# EAGLE design board (EAGLE 6.3)
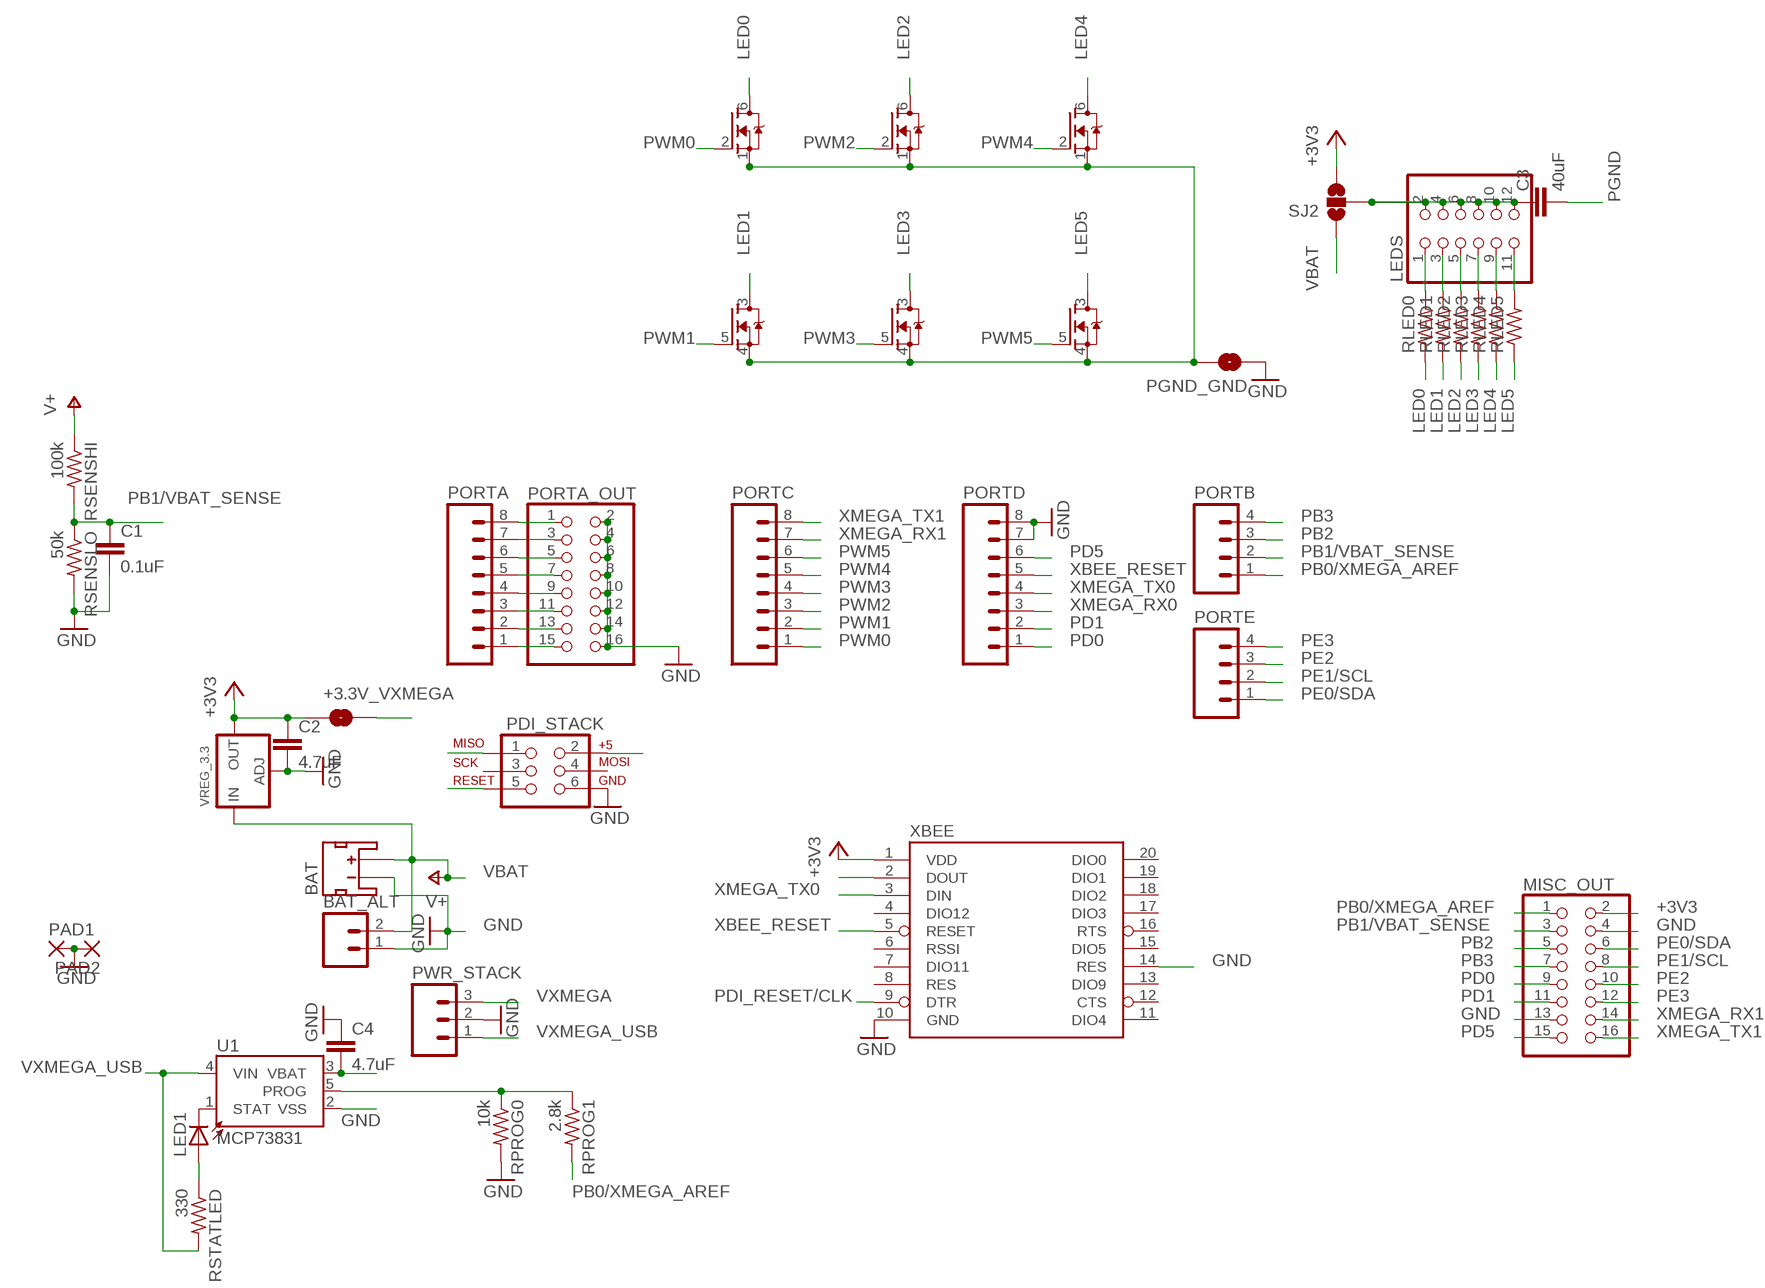
[diagram p0: schematic, sheet 1]

## Parts
+3.3V_VXMEGA  SOLDERJUMPERTRACE  [SJ_2S-TRACE]
BAT  JST_2MM_MALE  [JST-2-SMD]
BAT_ALT  M02PTH  [1X02]
C1  0.1uF  C-EUC0603K  [C0603K]
C2  4.7uF  C-EUC0805K  [C0805K]
C3  40uF  C-EUC1210  [C1210]
C4  4.7uF  C-EUC0805  [C0805]
DRV0  MOSFET-N_DUAL  [SOT363]
DRV1  MOSFET-N_DUAL  [SOT363]
DRV2  MOSFET-N_DUAL  [SOT363]
LED1  LEDCHIP-LED0603  [CHIP-LED0603]
LEDS  PINHD-2X6/90  [2X06/90]
MISC_OUT  PINHD-2X8/90  [2X08/90]
PAD1  3,81/1,4  [3,81/1,4]
PAD2  3,81/1,4  [3,81/1,4]
PDI_STACK  AVR_SPI_PRG_6NS  [2X3-NS]
PGND_GND  SOLDERJUMPERTRACE  [SJ_2S-TRACE]
PORTA  M081X08  [1X08]
PORTA_OUT  PINHD-2X8  [2X08]
PORTB  M04PTH  [1X04]
PORTC  M081X08  [1X08]
PORTD  M081X08  [1X08]
PORTE  M04PTH  [1X04]
PWR_STACK  M03PTH  [1X03]
RLED0  R-US_R0805  [R0805]
RLED1  R-US_R0805  [R0805]
RLED2  R-US_R0805  [R0805]
RLED3  R-US_R0805  [R0805]
RLED4  R-US_R0805  [R0805]
RLED5  R-US_R0805  [R0805]
RPROG0  10k  R-US_R0603  [R0603]
RPROG1  2.8k  R-US_R0603  [R0603]
RSENSHI  100k  R-US_R0603  [R0603]
RSENSLO  50k  R-US_R0603  [R0603]
RSTATLED  330  R-US_R0603  [R0603]
SJ2  SOLDERJUMPER_2WAY-OLDT  [SJ_2]
U1  MCP73831  [SOT23-5]
VREG_3.3  LM1117SOT223-WAVE  [SOT223-W]
XBEE  XBEE-1B2  [XBEE-SILK]

## Nets
+3V3 [PWR]: +3.3V_VXMEGA.1 C2.1 MISC_OUT.2 SJ2.3 VREG_3.3.2(OUT) XBEE.1(VDD)
GND [PWR]: BAT.1(-) BAT_ALT.1 C1.2 C2.2 C4.1 MISC_OUT.4 MISC_OUT.13 PAD1.1(P) PAD2.1(P) PDI_STACK.6 PGND_GND.1 PORTA_OUT.2 PORTA_OUT.4 PORTA_OUT.6 PORTA_OUT.8 PORTA_OUT.10 PORTA_OUT.12 PORTA_OUT.14 PORTA_OUT.16 PORTD.7 PORTD.8 PWR_STACK.2 RPROG0.2 RSENSLO.2 U1.2(VSS) VREG_3.3.1(ADJ) XBEE.10(GND) XBEE.14(RES)
LED0 [PWR]: DRV0.6(D) RLED0.1
LED0R [PWR]: LEDS.1 RLED0.2
LED1 [PWR]: DRV0.3(D) RLED1.1
LED1R [PWR]: LEDS.3 RLED1.2
LED2 [PWR]: DRV1.6(D) RLED2.1
LED2R [PWR]: LEDS.5 RLED2.2
LED3 [PWR]: DRV1.3(D) RLED3.1
LED3R [PWR]: LEDS.7 RLED3.2
LED4 [PWR]: DRV2.6(D) RLED4.1
LED4R [PWR]: LEDS.9 RLED4.2
LED5 [PWR]: DRV2.3(D) RLED5.1
LED5R [PWR]: LEDS.11 RLED5.2
N$2: LED1.C U1.1(STAT)
N$3: LED1.A RSTATLED.1
PA0: PORTA.1 PORTA_OUT.15
PA1: PORTA.2 PORTA_OUT.13
PA2: PORTA.3 PORTA_OUT.11
PA3: PORTA.4 PORTA_OUT.9
PA4: PORTA.5 PORTA_OUT.7
PA5: PORTA.6 PORTA_OUT.5
PA6: PORTA.7 PORTA_OUT.3
PA7: PORTA.8 PORTA_OUT.1
PB0/XMEGA_AREF: MISC_OUT.1 PORTB.1 RPROG1.2
PB1/VBAT_SENSE: C1.1 MISC_OUT.3 PORTB.2 RSENSHI.2 RSENSLO.1
PB2: MISC_OUT.5 PORTB.3
PB3: MISC_OUT.7 PORTB.4
PD0: MISC_OUT.9 PORTD.1
PD1: MISC_OUT.11 PORTD.2
PD5: MISC_OUT.15 PORTD.6
PDI_DATA: PDI_STACK.1
PDI_RESET/CLK: PDI_STACK.5 XBEE.9(DTR)
PE0/SDA: MISC_OUT.6 PORTE.1
PE1/SCL: MISC_OUT.8 PORTE.2
PE2: MISC_OUT.10 PORTE.3
PE3: MISC_OUT.12 PORTE.4
PGND [PWR]: C3.2 DRV0.1(S) DRV0.4(S) DRV1.1(S) DRV1.4(S) DRV2.1(S) DRV2.4(S) PGND_GND.2
PWM0: DRV0.2(G) PORTC.1
PWM1: DRV0.5(G) PORTC.2
PWM2: DRV1.2(G) PORTC.3
PWM3: DRV1.5(G) PORTC.4
PWM4: DRV2.2(G) PORTC.5
PWM5: DRV2.5(G) PORTC.6
RPROG: RPROG0.1 RPROG1.1 U1.5(PROG)
VBAT [PWR]: BAT.2(+) BAT_ALT.2 C4.2 RSENSHI.1 SJ2.1 U1.3(VBAT) VREG_3.3.3(IN) ; supply symbol labelled V+
VLED [PWR]: C3.1 LEDS.2 LEDS.4 LEDS.6 LEDS.8 LEDS.10 LEDS.12 SJ2.2
VXMEGA: +3.3V_VXMEGA.2 PDI_STACK.2 PWR_STACK.3
VXMEGA_USB [PWR]: PWR_STACK.1 RSTATLED.2 U1.4(VIN)
XBEE_RESET: PORTD.5 XBEE.5(RESET)
XMEGA_RX0: PORTD.3 XBEE.2(DOUT)
XMEGA_RX1: MISC_OUT.14 PORTC.7
XMEGA_TX0: PORTD.4 XBEE.3(DIN)
XMEGA_TX1: MISC_OUT.16 PORTC.8
Unconnected: BAT.NC1(PAD1) BAT.NC2(PAD2) PDI_STACK.3 PDI_STACK.4 XBEE.4(DIO12) XBEE.6(RSSI) XBEE.7(DIO11) XBEE.8(RES) XBEE.11(DIO4) XBEE.12(CTS) XBEE.13(DIO9) XBEE.15(DIO5) XBEE.16(RTS) XBEE.17(DIO3) XBEE.18(DIO2) XBEE.19(DIO1) XBEE.20(DIO0)

## Library data of the parts
+3.3V_VXMEGA PGND_GND = SparkFun-Passives:SOLDERJUMPER: Solder Jumper Standard SMD solder jumper. Used to automate production. Two varients : Normally Open and Normally Closed are the same, but have different paste layers. NC will have a large amount of paste and should jumper during reflow.
BAT = SparkFun-Connectors:JST_2MM_MALE: Mates to single-cell LiPo batteries. CONN-08352; PROD_ID: CONN-08352
BAT_ALT = SparkFun-Connectors:M02: Header 2 Standard 2-pin 0.1" header. Use with straight break away headers (SKU : PRT-00116), right angle break away headers (PRT-00553), swiss pins (PRT-00743), machine pins (PRT-00117), and female headers (PRT-00115). Molex polarized connector foot print use with SKU : PRT-08233 with associated crimp pins and housings.
C1-C4 = rcl:C-EU: CAPACITOR, European symbol
DRV0 DRV1 DRV2 = microbuilder:MOSFET-N_DUAL: Dual N-Channel MOSFET SOT363 (2.0x1.25mm) 2N7002PS - 60V, 320mA [Digikey: 568-5984-1-ND]
LED1 = led:LED: LED OSRAM: - CHIPLED LG R971, LG N971, LY N971, LG Q971, LY Q971, LO R971, LY R971 LH N974, LH R974 LS Q976, LO Q976, LY Q976 LO Q996 - Hyper CHIPLED LW Q18S LB Q993, LB Q99A, LB R99A - SideLED LS A670, LO A670, LY A670, LG A670, LP A670 LB A673, LV A673, LT A673, LW A673 LH A674 LY A675 LS A676, LA A676, LO A676, LY A676, LW A676 LS A679, LY A679, LG A679 - Hyper Micro SIDELED® LS Y876, LA Y876, LO Y876, LY Y876 LT Y87S - SmartLED LW L88C, LW L88S LB L89C, LB L89S, LG L890 LS L89K, LO L89K, LY L89K LS L896, LA L896, LO L896, LY L896 - TOPLED LS T670, LO T670, LY T670, LG T670, LP T670 LSG T670, LSP T670, LSY T670, LOP T670, LYG T670 LG T671, LOG T671, LSG T671 LB T673, LV T673, LT T673, LW T673 LH T674 LS T676, LA T676, LO T676, LY T676, LB T676, LH T676, LSB T676, LW T676 LB T67C, LV T67C, LT T67C, LS T67K, LO T67K, LY T67K, LW E67C LS E67B, LA E67B, LO E67B, LY E67B, LB E67C, LV E67C, LT E67C LW T67C LS T679, LY T679, LG T679 LS T770, LO T770, LY T770, LG T770, LP T770 LB T773, LV T773, LT T773, LW T773 LH T774 LS E675, LA E675, LY E675, LS T675 LS T776, LA T776, LO T776, LY T776, LB T776 LHGB T686 LT T68C, LB T68C - Hyper Mini TOPLED® LB M676 - Mini TOPLED Santana® LG M470 LS M47K, LO M47K, LY M47K Source: http://www.osram.convergy.de LUXEON: - LUMILED® LXK2-PW12-R00, LXK2-PW12-S00, LXK2-PW14-U00, LXK2-PW14-V00 LXK2-PM12-R00, LXK2-PM12-S00, LXK2-PM14-U00 LXK2-PE12-Q00, LXK2-PE12-R00, LXK2-PE12-S00, LXK2-PE14-T00, LXK2-PE14-U00 LXK2-PB12-K00, LXK2-PB12-L00, LXK2-PB12-M00, LXK2-PB14-N00, LXK2-PB14-P00, LXK2-PB14-Q00 LXK2-PR12-L00, LXK2-PR12-M00, LXK2-PR14-Q00, LXK2-PR14-R00 LXK2-PD12-Q00, LXK2-PD12-R00, LXK2-PD12-S00 LXK2-PH12-R00, LXK2-PH12-S00 LXK2-PL12-P00, LXK2-PL12-Q00, LXK2-PL12-R00 Source: www.luxeon.com KINGBRIGHT: KA-3528ASYC Source: www.kingbright.com
LEDS = pinhead:PINHD-2X6: PIN HEADER
MISC_OUT PORTA_OUT = pinhead:PINHD-2X8: PIN HEADER
PAD1 PAD2 = wirepad:3,81/1,4: THROUGH-HOLE PAD
PDI_STACK = SparkFun-Connectors:AVR_SPI_PRG_6: AVR ISP 6 Pin This is the reduced ISP connector for AVR programming. Common on Arduino. This footprint will take up less PCB space and can be used with a 10-pin to 6-pin adapter such as SKU: BOB-08508
PORTA PORTC PORTD = SparkFun-Connectors:M08: Header 8 Standard 8-pin 0.1" header. Use with straight break away headers (SKU : PRT-00116), right angle break away headers (PRT-00553), swiss pins (PRT-00743), machine pins (PRT-00117), and female headers (PRT-00115).
PORTB PORTE = SparkFun-Connectors:M04: Header 4 Standard 4-pin 0.1" header. Use with straight break away headers (SKU : PRT-00116), right angle break away headers (PRT-00553), swiss pins (PRT-00743), machine pins (PRT-00117), and female headers (PRT-00115). Molex polarized connector foot print use with SKU : PRT-08231 with associated crimp pins and housings. 1MM SMD Version SKU: PRT-10208
PWR_STACK = SparkFun-Connectors:M03: Header 3 Standard 3-pin 0.1" header. Use with straight break away headers (SKU : PRT-00116), right angle break away headers (PRT-00553), swiss pins (PRT-00743), machine pins (PRT-00117), and female headers (PRT-00115). Molex polarized connector foot print use with SKU : PRT-08232 with associated crimp pins and housings.
RLED0 RLED1-RLED5 = resistor:R-US_: RESISTOR, American symbol
RPROG0 RPROG1 RSENSHI RSENSLO RSTATLED = rcl:R-US_: RESISTOR, American symbol
SJ2 = SparkFun-Passives:SOLDERJUMPER_2WAY-OLD: Solder Jumper 2 way solder jumper
U1 = SparkFun-PowerIC:MCP73831: Miniature single cell, fully integrated Li-Ion, Li-polymer charge management controller http://ww1.microchip.com/downloads/en/DeviceDoc/21984a.pdf
VREG_3.3 = microbuilder:LM1117: LM1117 Voltage Regulator LM1117 Adjustable Voltage regulator [Digikey: LM1117IMP-ADJDKR-ND] LM1117 3.3V Voltage regulator [AP1117E33GDIDKR-ND] LM1117 5.0V Voltage regulator [AP1117E50GDIDKR-ND] SOT223-REFLOW - SOT223 package for solder paste/reflow ovens SOT223-WAVE - SOT223 package for hand-soldering (larger pads) Note: For the fixed-voltage regulators, simply set the ADJ pin to GND.
XBEE = SparkFun-RF:XBEE-1: Xbee module footprints SMT header is CONN-09042.

## Net classes
1 PWR: width 0.305 mm

## Board
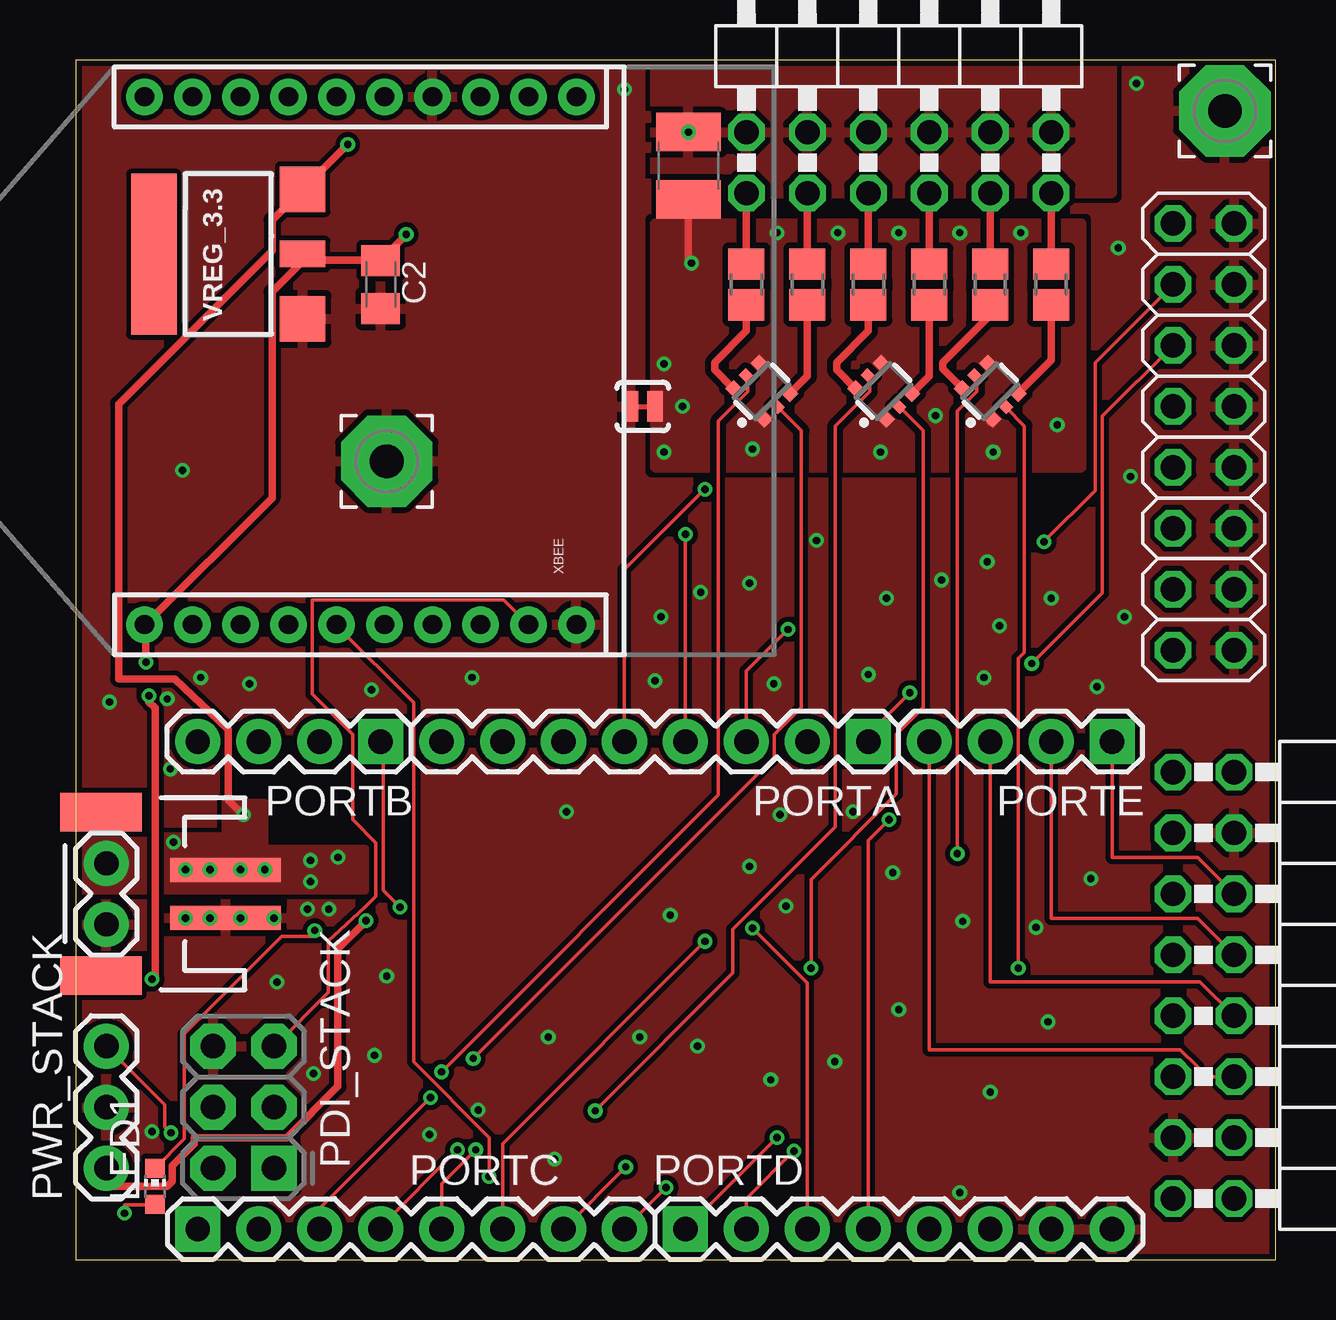
[diagram p1: board, top side]
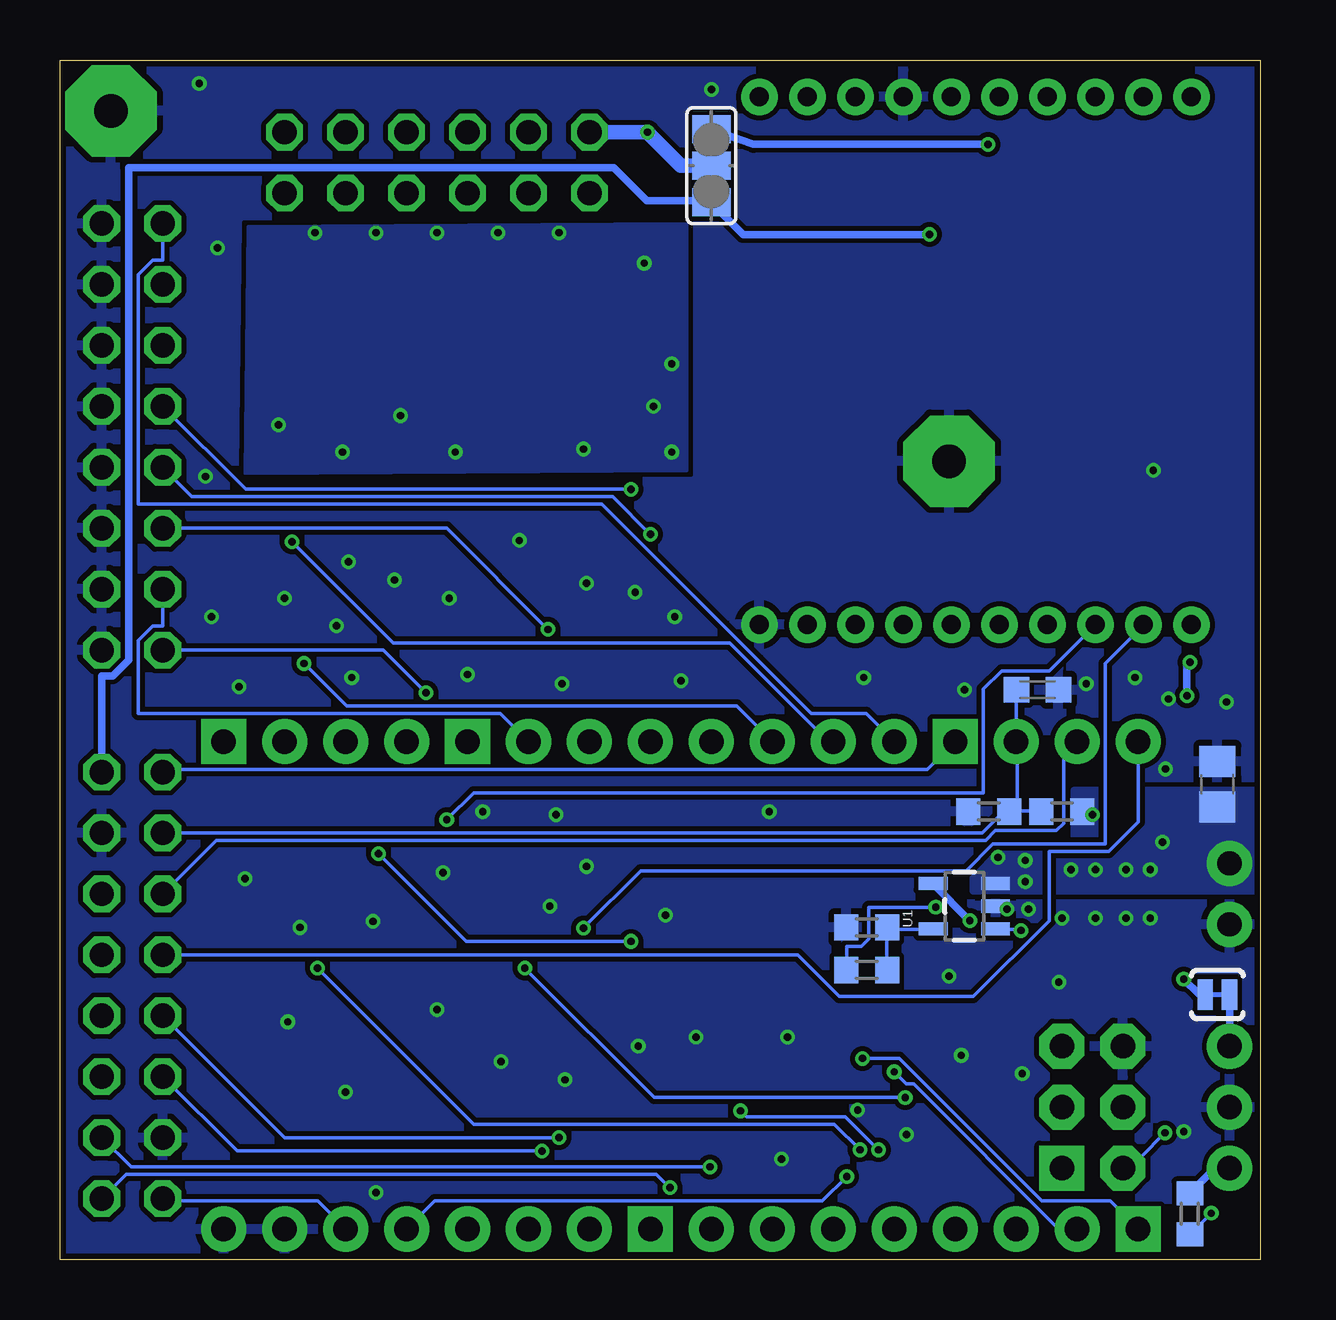
[diagram p2: board, bottom side, seen from below]

Size 50 x 50 mm. Coordinates in mm from the lower left corner, seen from the top.
Outline: 0,0 50,0 50,50 0,50 0,0
Copper layers (1*16): Top 0.035mm / dielectric 1.5mm / Bottom 0.035mm
Design rules "Fusion_eagle_rule_v1.1": minimum track width 6mil, minimum drill 12mil, track to track 6mil, track to pad 6mil, pad to pad 6mil, via to via 6mil, smd to smd 0mil, copper to edge 10mil, drill to drill 10mil, minimum pad ring 10mil, minimum via ring 6mil, stop-mask expansion 2mil, vias tented up to drill 100mil, thermal gap 10mil

### Footprints (pad centres in the part's own frame; a part is rotated, then mirrored left to right if it is on the bottom)
SJ_2S-TRACE = smd 0.635 x 1.27: 1 -0.508,0; 2 0.508,0
JST-2-SMD = smd 1 x 4.6: 1 -1,-3.7; 2 1,-3.7 | smd 1.6 x 3.4: NC1 -3.4,1.5; NC2 3.4,1.5
1X02 = drill 1.016 pad 1.88: 1 0,0; 2 2.54,0
C0603K = smd 1.05 x 1.08: 1 -0.875,0; 2 0.875,0
C0805K = smd 1.3 x 1.6: 1 -1,0; 2 1,0
C1210 = smd 1.6 x 2.7: 1 -1.4,0; 2 1.4,0
C0805 = smd 1.3 x 1.5: 1 -0.95,0; 2 0.95,0
SOT363 = smd 0.5 x 0.5: 1 -0.75,-0.9; 3 0.75,-0.9; 4 0.75,0.9; 6 -0.75,0.9 | smd 0.4 x 0.5: 2 0,-0.9; 5 0,0.9
CHIP-LED0603 = smd 0.8 x 0.8: A 0,-0.75; C 0,0.75
2X06/90 = drill 1.016 octagon: 1 -6.35,-6.35; 2 -6.35,-3.81; 3 -3.81,-6.35; 4 -3.81,-3.81; 5 -1.27,-6.35; 6 -1.27,-3.81; 7 1.27,-6.35; 8 1.27,-3.81; 9 3.81,-6.35; 10 3.81,-3.81; 11 6.35,-6.35; 12 6.35,-3.81
2X08/90 = drill 1.016 octagon: 1 -8.89,-6.35; 2 -8.89,-3.81; 3 -6.35,-6.35; 4 -6.35,-3.81; 5 -3.81,-6.35; 6 -3.81,-3.81; 7 -1.27,-6.35; 8 -1.27,-3.81; 9 1.27,-6.35; 10 1.27,-3.81; 11 3.81,-6.35; 12 3.81,-3.81; 13 6.35,-6.35; 14 6.35,-3.81; 15 8.89,-6.35; 16 8.89,-3.81
3,81/1,4 = drill 1.397 pad 3.81 octagon: 1 0,0
2X3-NS = drill 1.016 pad 1.88 square: 1 -2.54,-1.27 | drill 1.016 pad 1.88 octagon: 2 -2.54,1.27; 3 0,-1.27; 4 0,1.27; 5 2.54,-1.27; 6 2.54,1.27
1X08 = drill 1.016 pad 1.88 square: 1 0,0 | drill 1.016 pad 1.88: 2 2.54,0; 3 5.08,0; 4 7.62,0; 5 10.16,0; 6 12.7,0; 7 15.24,0; 8 17.78,0
2X08 = drill 1.016 octagon: 1 -8.89,-1.27; 2 -8.89,1.27; 3 -6.35,-1.27; 4 -6.35,1.27; 5 -3.81,-1.27; 6 -3.81,1.27; 7 -1.27,-1.27; 8 -1.27,1.27; 9 1.27,-1.27; 10 1.27,1.27; 11 3.81,-1.27; 12 3.81,1.27; 13 6.35,-1.27; 14 6.35,1.27; 15 8.89,-1.27; 16 8.89,1.27
1X04 = drill 1.016 pad 1.88 square: 1 0,0 | drill 1.016 pad 1.88: 2 2.54,0; 3 5.08,0; 4 7.62,0
1X03 = drill 1.016 pad 1.88: 1 0,0; 2 2.54,0; 3 5.08,0
R0805 = smd 1.3 x 1.5: 1 -0.85,0; 2 0.85,0
R0603 = smd 1 x 1.1: 1 -0.85,0; 2 0.85,0
SJ_2 = smd 1.168 x 1.6: 1 -1.524,0; 2 0,0; 3 1.524,0
SOT23-5 = smd 0.55 x 1.2: 1 -0.95,-1.3; 2 0,-1.3; 3 0.95,-1.3; 4 0.95,1.3; 5 -0.95,1.3
SOT223-W = smd 1.9 x 1.9: 1 -2.7,-3.1; 3 2.7,-3.1 | smd 1.1 x 1.9: 2 0,-3.1 | smd 6.7 x 1.9: 4 0,3.1
XBEE-SILK = drill 0.8 pad 1.524: 1 -11,20; 2 -11,18; 3 -11,16; 4 -11,14; 5 -11,12; 6 -11,10; 7 -11,8; 8 -11,6; 9 -11,4; 10 -11,2; 11 11,2; 12 11,4; 13 11,6; 14 11,8; 15 11,10; 16 11,12; 17 11,14; 18 11,16; 19 11,18; 20 11,20

### Placement (x,y rotation side)
+3.3V_VXMEGA  1.78,11.05 0 bottom
BAT  2.54,15.24 90 top
BAT_ALT  1.27,13.97 90 top
C1  9.27,23.75 0 bottom
C2  12.7,40.64 270 top
C3  25.53,45.59 270 top
C4  1.78,19.81 270 bottom
DRV0  28.57,36.2 45 top
DRV1  33.66,36.2 45 top
DRV2  38.1,36.2 45 top
LED1  3.3,3.05 0 top
LEDS  34.29,50.8 0 top
MISC_OUT  52.07,11.43 270 top
PAD1  47.88,47.88 0 top
PAD2  12.95,33.27 0 top
PDI_STACK  6.99,6.35 90 top
PGND_GND  23.62,35.56 0 top
PORTA  33.02,21.59 180 top
PORTA_OUT  46.99,34.29 270 top
PORTB  12.7,21.59 180 top
PORTC  5.08,1.27 0 top
PORTD  25.4,1.27 0 top
PORTE  43.18,21.59 180 top
PWR_STACK  1.27,3.81 90 top
RLED0  27.94,40.64 90 top
RLED1  30.48,40.64 90 top
RLED2  33.02,40.64 90 top
RLED3  35.56,40.64 90 top
RLED4  38.1,40.64 90 top
RLED5  40.64,40.64 90 top
RPROG0  16.38,13.84 180 bottom
RPROG1  16.38,12.06 180 bottom
RSENSHI  8.26,18.67 180 bottom
RSENSLO  11.3,18.67 180 bottom
RSTATLED  2.92,1.91 90 bottom
SJ2  22.86,45.59 270 bottom
U1  12.32,14.73 90 bottom
VREG_3.3  6.35,41.91 90 top
XBEE  22.86,37.47 90 top

### Tracks (layer width: path | path; a pad name or v marks a point on that pad's centre or on a via)
+3V3  (via drill 0.3)
  Top 0.305: v13.77,42.72 12.8,41.76 C2.1 12.7,41.66 9.5,41.66 9.5,41.91 VREG_3.3.2 9.4,41.55 8.18,40.34 8.18,31.75 2.9,26.47 XBEE.1 2.92,26.42 v2.92,24.89 | v3.17,11.68 3.3,11.81 3.3,22.99 3.05,23.24 v3.05,23.5
  Bottom 0.305: v13.77,42.72 21.54,42.72 22.86,44.04 SJ2.3 22.96,44.15 25.55,44.15 26.92,45.52 47.14,45.52 47.14,24.99 47.8,24.33 48.26,24.33 MISC_OUT.2 | v3.05,23.5 3.05,24.89 v2.92,24.89 | +3.3V_VXMEGA.1 2.54,11.05 v3.17,11.68
GND  (via drill 0.3, 0.3 pad 0.61)
  other vias: 22.86,48.77 44.2,49.02 43.43,42.16 9.65,14.61 8.26,14.22 6.86,14.22 5.59,14.22 4.45,32.89 16.51,24.26 34.04,16.13 34.29,10.41 38.1,6.99 40.51,9.91 42.29,15.88 40.01,13.84 36.96,14.1 31.62,8.26 28.96,7.49 25.91,8.89 23.5,9.27 19.68,9.27 24.77,14.35 28.07,16.38 20.45,18.67 12.45,8.51 12.95,11.81 5.21,24.26 7.24,24 3.81,23.37 12.32,23.75 8.38,11.56 9.91,7.75 16.76,6.22 14.73,5.21 3.17,5.33 42.55,23.88 43.69,26.8 40.64,27.56 37.97,29.08 33.78,27.56 33.02,24.38 28.07,28.19 36.07,28.32 38.48,26.42 37.85,24.26 29.08,24 24.13,24.13 24.38,26.8 26.04,27.81 30.86,29.97 43.94,32.64 29.34,18.54 32.38,18.67 29.59,14.73 10.54,14.61 1.4,23.24 3.94,20.45 4.57,14.22 36.83,2.79 19.94,4.19
  pour Top (isolate 0.203, rank 6): -1.27,50.8 -1.27,-1.27 50.8,-1.27 50.8,50.8
  pour Bottom (isolate 0.203, rank 6): -2.54,52.07 -2.54,-2.54 53.34,-2.54 53.34,52.07
LED0
  Top 0.305: DRV0.6 27.38,36.32 26.62,37.08 26.62,37.39 27.94,38.71 27.94,39.78 RLED0.1
LED0R
  Top 0.305: RLED0.2 LEDS.1
LED1
  Top 0.305: DRV0.3 29.77,36.12 30.48,36.83 30.48,39.78 RLED1.1
LED1R
  Top 0.305: RLED1.2 LEDS.3
LED2
  Top 0.305: DRV1.6 32.46,36.32 31.7,37.08 31.7,37.39 33.02,38.71 33.02,39.78 RLED2.1
LED2R
  Top 0.305: RLED2.2 LEDS.5
LED3
  Top 0.305: DRV1.3 34.85,36.12 35.56,36.83 35.56,39.78 RLED3.1
LED3R
  Top 0.305: RLED3.2 LEDS.7
LED4
  Top 0.305: DRV2.6 36.93,36.32 36.12,37.13 36.12,37.39 38.1,39.37 38.1,39.78 RLED4.1
LED4R
  Top 0.305: RLED4.2 LEDS.9
LED5
  Top 0.305: DRV2.3 39.27,36.12 40.64,37.49 40.64,39.78 RLED5.1
LED5R
  Top 0.305: RLED5.2 LEDS.11
N$2  (via drill 0.3)
  Top 0.152: v9.96,13.72 9.96,13.46 8.59,13.46 4.52,9.4 4.52,5.03 LED1.C
  Bottom 0.152: v9.96,13.72 10.01,13.77 10.97,13.77 U1.1
N$3  (via drill 0.3)
  Top 0.152: v2.03,1.93 2.03,2.29 3.3,2.29 LED1.A
  Bottom 0.152: v2.03,1.93 2.9,1.07 RSTATLED.1
PA0  (via drill 0.3)
  Top 0.152: v34.75,23.62 33.02,21.89 PORTA.1
  Bottom 0.152: PORTA_OUT.15 36.52,25.4 v34.75,23.62
PA1
  Bottom 0.152: PORTA_OUT.13 45.72,26.42 46.13,26.42 46.74,25.81 46.74,22.76 31.65,22.76 PORTA.2
PA2  (via drill 0.3)
  Top 0.152: v29.67,26.26 27.94,24.54 PORTA.3
  Bottom 0.152: PORTA_OUT.11 33.88,30.48 v29.67,26.26
PA3  (via drill 0.3)
  Top 0.152: PORTA.4 v25.4,30.23
  Bottom 0.152: PORTA_OUT.9 44.5,31.8 26.98,31.8 v25.4,30.23
PA4  (via drill 0.3)
  Top 0.152: v26.21,32.11 22.86,28.75 PORTA.5
  Bottom 0.152: PORTA_OUT.7 42.27,32.11 v26.21,32.11
PA5  (via drill 0.3)
  Top 0.152: PORTA_OUT.5 42.77,35.15 42.77,27.79 v39.83,24.84
  Bottom 0.152: v39.83,24.84 38.05,23.06 21.79,23.06 PORTA.6
PA6  (via drill 0.3)
  Top 0.152: PORTA_OUT.3 42.47,37.39 42.47,32.05 v40.34,29.92
  Bottom 0.152: v40.34,29.92 36.12,25.7 22.1,25.7 17.98,21.59 PORTA.7
PA7
  Bottom 0.152: PORTA_OUT.1 45.72,41.66 46.13,41.66 46.74,41.05 46.74,31.5 27.43,31.5 18.69,22.76 16.41,22.76 PORTA.8
PB0/XMEGA_AREF  (via drill 0.3)
  Top 0.152: v13.51,14.68 12.8,15.39 12.8,21.49 PORTB.1
  Bottom 0.152: v13.51,14.68 16.31,14.68 16.31,13.36 16.61,13.06 17.22,13.06 17.22,12.09 RPROG1.2 | MISC_OUT.1 45.62,20.42 13.87,20.42 PORTB.1
PB1/VBAT_SENSE
  Bottom 0.152: RSENSHI.2 9.14,18.69 10.41,18.69 RSENSLO.1 | C1.1 10.16,23.72 PORTB.2 10.11,21.54 10.11,18.75 RSENSLO.1 | MISC_OUT.3 11.58,17.78 10.72,18.64 10.52,18.64 RSENSLO.1
PB2
  Bottom 0.152: MISC_OUT.5 43.48,17.48 11.43,17.48 11.02,17.88 8.48,17.88 8.18,18.19 8.18,21.59 PORTB.3
PB3
  Bottom 0.152: MISC_OUT.7 19.25,12.7 17.53,10.97 11.94,10.97 8.79,14.12 8.79,17.02 6.3,17.02 5.08,18.24 PORTB.4
PD0  (via drill 0.3)
  Top 0.152: PORTD.1 v29.21,5.08
  Bottom 0.152: MISC_OUT.9 40.64,5.08 v29.21,5.08
PD1  (via drill 0.3)
  Top 0.152: v29.92,4.52 27.94,2.54 PORTD.2
  Bottom 0.152: MISC_OUT.11 42.62,4.52 v29.92,4.52
PD5
  Bottom 0.152: MISC_OUT.15 45.62,2.44 39.27,2.44 PORTD.6
PDI_RESET/CLK
  Top 0.152: XBEE.9 18.85,26.47 17.83,27.48 9.86,27.48 9.86,23.57 11.53,21.89 11.53,18.34 12.5,17.37 12.5,15.14 12.04,14.68 10.52,13.28 10.52,11.12 8.28,8.89 PDI_STACK.5
PE0/SDA
  Top 0.152: MISC_OUT.6 46.74,16.76 43.18,16.76 PORTE.1
PE1/SCL
  Top 0.152: MISC_OUT.8 46.74,14.22 40.64,14.22 PORTE.2
PE2
  Top 0.152: MISC_OUT.10 46.84,11.58 38.1,11.58 PORTE.3
PE3
  Top 0.152: MISC_OUT.12 46.74,7.62 46.74,8.03 46.02,8.74 35.56,8.74 PORTE.4
PGND  (via drill 0.3 pad 0.61)
  Top 0.305: 25.53,41.59 C3.2 | 38.1,34.9 38.2,35 DRV2.1
  other vias: 36.83,42.8 34.29,42.8 31.75,42.8 29.21,42.8 25.65,41.53 39.37,42.8 40.89,34.8 35.81,35.18 24.51,33.66 25.27,35.56 24.51,37.34 33.53,33.66 38.23,33.66 28.19,33.78
  pour Top (isolate 0.254, rank 3, no thermals): 24.13,43.18 24.13,33.02 41.91,33.02 41.91,43.18
  pour Bottom (isolate 0.203, rank 3): 23.88,32.89 23.88,43.18 42.16,43.05 42.29,32.77
PWM0  (via drill 0.3)
  Top 0.152: v16.56,8.38 29.11,20.93 29.11,21.89 30.23,23.01 30.23,34.54 29.26,35.51 DRV0.2
  Bottom 0.152: v16.56,8.38 15.04,8.38 9.09,2.44 6.25,2.44 PORTC.1
PWM1  (via drill 0.3)
  Top 0.152: v15.24,7.82 26.77,19.36 26.77,34.95 27.99,36.17 27.99,36.78 DRV0.5
  Bottom 0.152: v15.24,7.82 14.73,7.32 14.43,7.32 8.38,1.27 PORTC.2
PWM2  (via drill 0.3)
  Top 0.152: v30.63,12.14 30.63,15.85 34.19,19.41 34.19,21.89 35.31,23.01 35.31,34.54 34.34,35.51 DRV1.2 | v14.78,6.76 10.16,2.13 PORTC.3
  Bottom 0.152: v30.63,12.14 25.25,6.76 v14.78,6.76
PWM3  (via drill 0.3)
  Top 0.152: v21.64,6.2 27.38,11.94 27.38,13.77 31.65,18.03 31.65,34.75 33.07,36.17 33.07,36.78 DRV1.5 | v15.9,4.57 12.7,1.37 PORTC.4
  Bottom 0.152: v21.64,6.2 21.39,5.94 17.27,5.94 v15.9,4.57
PWM4  (via drill 0.3)
  Top 0.152: v39.27,12.14 39.27,25.04 39.52,25.3 39.52,34.75 38.76,35.51 DRV2.2 | v16.66,4.57 15.24,3.15 PORTC.5
  Bottom 0.152: v39.27,12.14 32.77,5.64 17.73,5.64 v16.66,4.57
PWM5  (via drill 0.3)
  Top 0.152: v36.73,16.92 36.73,35.36 37.54,36.17 37.54,36.78 37.49,36.83 DRV2.5 | v26.21,13.26 17.78,4.83 PORTC.6
  Bottom 0.152: v36.73,16.92 33.07,13.26 v26.21,13.26
RPROG
  Bottom 0.152: RPROG1.1 15.54,12.09 15.54,13.82 RPROG0.1 15.49,13.77 13.66,13.77 U1.5
VBAT  (via drill 0.3)
  Top 0.305: v11.33,46.48 9.5,44.65 VREG_3.3.3 9.35,44.5 8.18,43.33 8.18,42.06 1.78,35.66 1.78,24.21 4.12,24.21 6.35,22.1 6.35,19.15 6.96,18.54 v6.99,18.54
  Bottom 0.305: v11.33,46.48 21.11,46.48 22.86,47.09 SJ2.1
  other vias: 9.78,16.64 7.87,16.26 6.86,16.26 5.59,16.26 9.78,15.75 10.92,16.76 4.57,16.26 4.06,17.4
  pour Bottom (isolate 0.203, rank 5, no thermals): -3.68,18.54 -3.68,15.37 11.94,15.37 11.94,17.14 7.75,17.14 7.75,19.56 -3.68,19.56 -3.68,18.67
  pour Top (isolate 0.203, rank 5, no thermals): -5.08,17.65 -5.08,15.37 12.06,15.37 12.06,17.14 7.87,17.14 7.87,19.05 6.22,19.05 6.22,17.65
VLED  (via drill 0.3)
  Bottom 0.61: SJ2.2 24.13,45.59 C3.1 LEDS.2
  other vias: 25.53,46.99
  pour Top (isolate 0.254, rank 5): 24.13,53.34 24.13,44.45 43.18,44.45 43.18,53.34
VXMEGA  (via drill 0.3)
  Top 0.152: v3.96,5.28 3.71,5.54 3.71,6.45 PWR_STACK.3
  Bottom 0.152: v3.96,5.28 4.98,4.27 5.23,4.27 5.69,3.81 PDI_STACK.2
  Bottom 0.305: PWR_STACK.3 +3.3V_VXMEGA.2
VXMEGA_USB  (via drill 0.3)
  Top 0.305: v12.09,14.12 10.92,12.95 10.92,7.21 8.79,5.08 4.93,5.08 4.93,4.83 4.01,3.91 4.01,3.25 3.81,3.05 1.27,3.05 PWR_STACK.1
  Bottom 0.305: PWR_STACK.1 1.88,3.81 2.9,2.79 RSTATLED.2 | v12.09,14.12 13.61,15.65 U1.4
XBEE_RESET  (via drill 0.3)
  Top 0.152: v17.22,3.45 17.22,5.08 14.07,8.23 14.07,23.22 10.87,26.42 XBEE.5
  Bottom 0.152: v17.22,3.45 18.24,2.44 34.39,2.44 PORTD.5
XMEGA_RX0  (via drill 0.3)
  Top 0.152: v28.19,13.82 30.48,11.53 PORTD.3
  Bottom 0.152: v28.19,13.82 25.81,16.2 12.24,16.2 11.12,17.32 6.45,17.32 6.45,24.84 4.88,26.42 XBEE.2
XMEGA_RX1  (via drill 0.3)
  Top 0.152: PORTC.7 v22.91,3.86
  Bottom 0.152: MISC_OUT.14 47.04,3.86 v22.91,3.86
XMEGA_TX0  (via drill 0.3)
  Top 0.152: v33.88,18.34 33.02,17.48 PORTD.4
  Bottom 0.152: v33.88,18.34 32.77,19.46 11.53,19.46 11.53,23.77 10.77,24.54 8.79,24.54 6.91,26.42 XBEE.3
XMEGA_TX1  (via drill 0.3)
  Top 0.152: PORTC.8 v24.59,3
  Bottom 0.152: MISC_OUT.16 47.24,3.56 25.15,3.56 v24.59,3